# Altium schematic sheet GD_Tcontroller.SchDoc
size A4
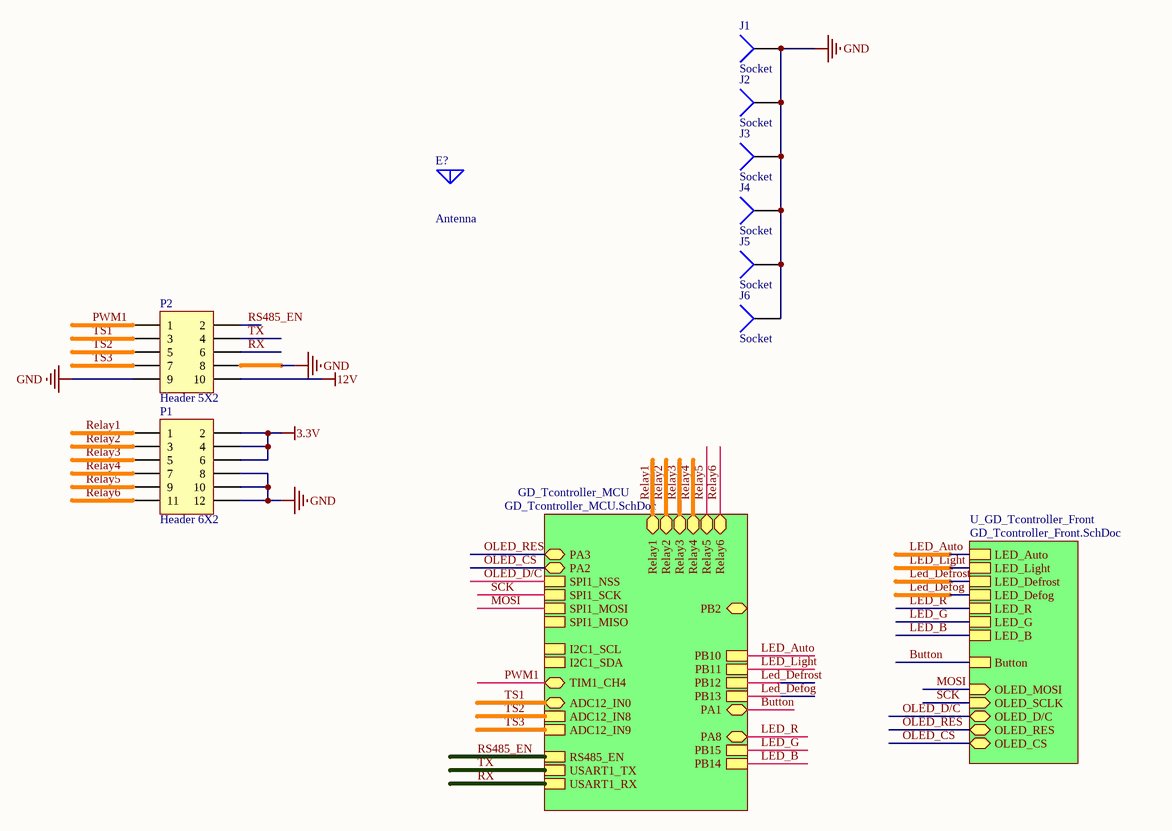
[diagram p0: GD_Tcontroller.SchDoc]

## Parts
E?  Antenna  [OLED]
J1  Socket  [SCREWFG3_2]
J2  Socket  [SCREWFG3_2]
J3  Socket  [SCREWFG3_2]
J4  Socket  [SCREWFG3_2]
J5  Socket  [SCREWFG3_2]
J6  Socket  [SCREWFG3_2]
P1  Header 6X2  [DC3-12P]
P2  Header 5X2  [DC3-10P]

## Sub-sheets
GD_Tcontroller_MCU = GD_Tcontroller_MCU.SchDoc: USART1_TX, USART1_RX, SPI1_SCK, SPI1_MISO, SPI1_MOSI, SPI1_NSS, I2C1_SCL, I2C1_SDA, ADC12_IN8, ADC12_IN9, RS485_EN, PB10, PB11, PB12, PB13, PB14, PB15, PA2, PA3, PB2, Relay1, Relay5, Relay4, Relay3, Relay6, Relay2, TIM1_CH4, PA1, ADC12_IN0, PA8
U_GD_Tcontroller_Front = GD_Tcontroller_Front.SchDoc: LED_B, LED_G, LED_R, Button, LED_Auto, LED_Light, LED_Defrost, LED_Defog, OLED_MOSI (in), OLED_SCLK (in), OLED_D/C (bidir), OLED_RES (bidir), OLED_CS (bidir)

## Nets
3.3V: P1.2 P1.4 P1.6
12V: P2.10
GND: J1.1 J2.1 J3.1 J4.1 J5.1 J6.1 P1.8 P1.10 P1.12 P2.8 P2.9
Button: sheet GD_Tcontroller_MCU/PA1, sheet U_GD_Tcontroller_Front/Button
LED_Auto: sheet GD_Tcontroller_MCU/PB10, sheet U_GD_Tcontroller_Front/LED_Auto
LED_B: sheet GD_Tcontroller_MCU/PB14, sheet U_GD_Tcontroller_Front/LED_B
Led_Defog: sheet GD_Tcontroller_MCU/PB13, sheet U_GD_Tcontroller_Front/LED_Defog
Led_Defrost: sheet GD_Tcontroller_MCU/PB12, sheet U_GD_Tcontroller_Front/LED_Defrost
LED_G: sheet GD_Tcontroller_MCU/PB15, sheet U_GD_Tcontroller_Front/LED_G
LED_Light: sheet GD_Tcontroller_MCU/PB11, sheet U_GD_Tcontroller_Front/LED_Light
LED_R: sheet GD_Tcontroller_MCU/PA8, sheet U_GD_Tcontroller_Front/LED_R
MOSI: sheet GD_Tcontroller_MCU/SPI1_MOSI, sheet U_GD_Tcontroller_Front/OLED_MOSI
OLED_CS: sheet GD_Tcontroller_MCU/PA2, sheet U_GD_Tcontroller_Front/OLED_CS
OLED_D/C: sheet GD_Tcontroller_MCU/SPI1_NSS, sheet U_GD_Tcontroller_Front/OLED_D/C
OLED_RES: sheet GD_Tcontroller_MCU/PA3, sheet U_GD_Tcontroller_Front/OLED_RES
PWM1: P2.1 ; sheet GD_Tcontroller_MCU/TIM1_CH4
Relay1: P1.1 ; sheet GD_Tcontroller_MCU/Relay1
Relay2: P1.3 ; sheet GD_Tcontroller_MCU/Relay2
Relay3: P1.5 ; sheet GD_Tcontroller_MCU/Relay3
Relay4: P1.7 ; sheet GD_Tcontroller_MCU/Relay4
Relay5: P1.9 ; sheet GD_Tcontroller_MCU/Relay5
Relay6: P1.11 ; sheet GD_Tcontroller_MCU/Relay6
RS485_EN: P2.2 ; sheet GD_Tcontroller_MCU/RS485_EN
RX: P2.6 ; sheet GD_Tcontroller_MCU/USART1_RX
SCK: sheet GD_Tcontroller_MCU/SPI1_SCK, sheet U_GD_Tcontroller_Front/OLED_SCLK
TS1: P2.3 ; sheet GD_Tcontroller_MCU/ADC12_IN0
TS2: P2.5 ; sheet GD_Tcontroller_MCU/ADC12_IN8
TS3: P2.7 ; sheet GD_Tcontroller_MCU/ADC12_IN9
TX: P2.4 ; sheet GD_Tcontroller_MCU/USART1_TX

## Library data of the parts
E? = Antenna: Generic Antenna; Published: 24-Mar-1999; LatestRevisionDate: 17-Jul-2002; LatestRevisionNote: Re-released for DXP Platform.; PackageReference: PIN1; Publisher: Altium Limited
P1 = Header 6X2: Header, 6-Pin, Dual row; LatestRevisionDate: 17-Jul-2002; LatestRevisionNote: Re-released for DXP Platform.; Publisher: Altium Limited
P2 = Header 5X2: Header, 5-Pin, Dual row; LatestRevisionDate: 17-Jul-2002; LatestRevisionNote: Re-released for DXP Platform.; Publisher: Altium Limited
J1-J6 = Socket: LatestRevisionDate: 17-Jul-2002; LatestRevisionNote: Re-released for DXP Platform.; Publisher: Altium Limited